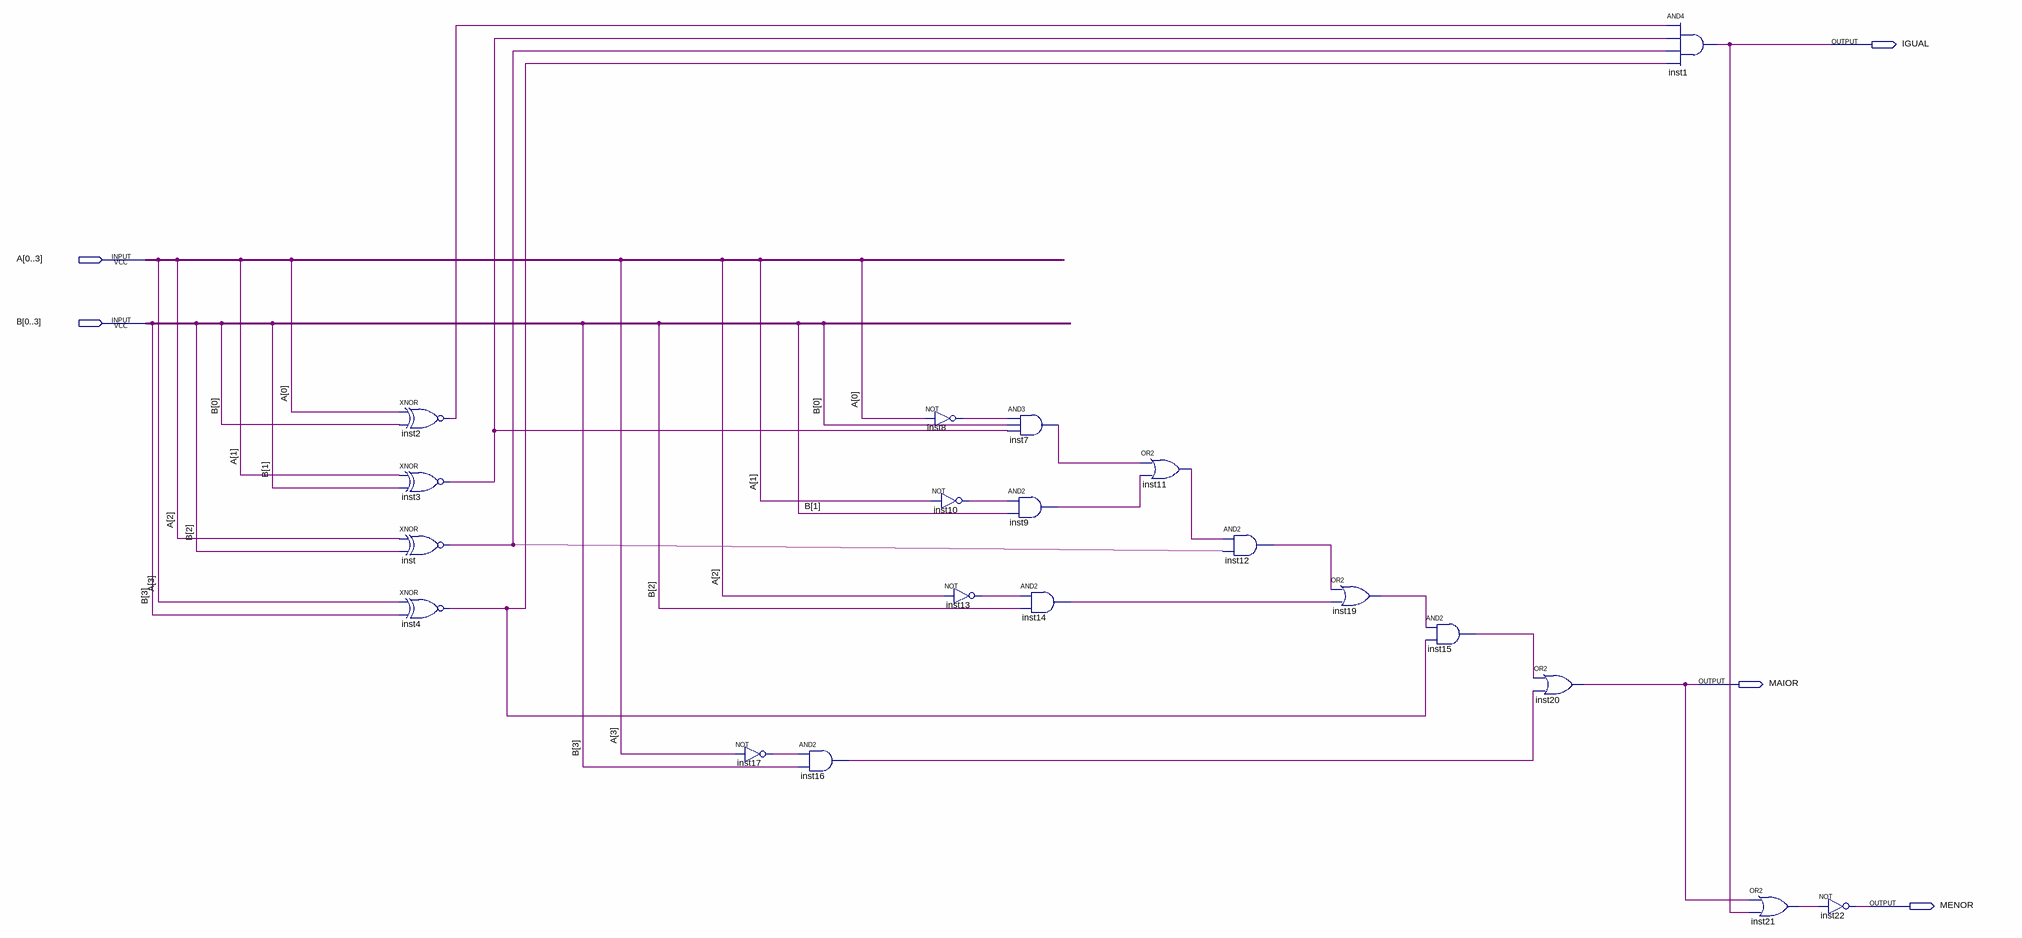
[diagram p0: schematic sheet]
// Quartus schematic COMPARADOR.bdf as structural Verilog: 20 symbols, 5 pins
module COMPARADOR (
  input  [0:3] A,
  input  [0:3] B,
  output IGUAL,
  output MAIOR,
  output MENOR
);

  wire inst2_out, inst3_out, inst4_out, inst7_out, inst8_out, inst9_out, inst10_out, inst11_out, inst12_out,
       inst13_out, inst14_out, inst15_out, inst16_out, inst17_out, inst19_out, inst21_out, inst_out;

  xnor inst2 (inst2_out, A[0], B[0]);
  xnor inst3 (inst3_out, A[1], B[1]);
  xnor inst (inst_out, A[2], B[2]);
  xnor inst4 (inst4_out, A[3], B[3]);
  not inst17 (inst17_out, A[3]);
  and inst16 (inst16_out, inst17_out, B[3]);
  not inst8 (inst8_out, A[0]);
  not inst10 (inst10_out, A[1]);
  not inst13 (inst13_out, A[2]);
  and inst7 (inst7_out, inst8_out, B[0], inst3_out);
  and inst9 (inst9_out, inst10_out, B[1]);
  and inst14 (inst14_out, inst13_out, B[2]);
  or inst11 (inst11_out, inst7_out, inst9_out);
  and inst12 (inst12_out, inst11_out, inst_out);
  or inst19 (inst19_out, inst12_out, inst14_out);
  and inst15 (inst15_out, inst19_out, inst4_out);
  or inst20 (MAIOR, inst15_out, inst16_out);
  and inst1 (IGUAL, inst2_out, inst3_out, inst_out, inst4_out);
  or inst21 (inst21_out, MAIOR, IGUAL);
  not inst22 (MENOR, inst21_out);
endmodule
